# Altium schematic sheet Sheet1.SchDoc
size A4
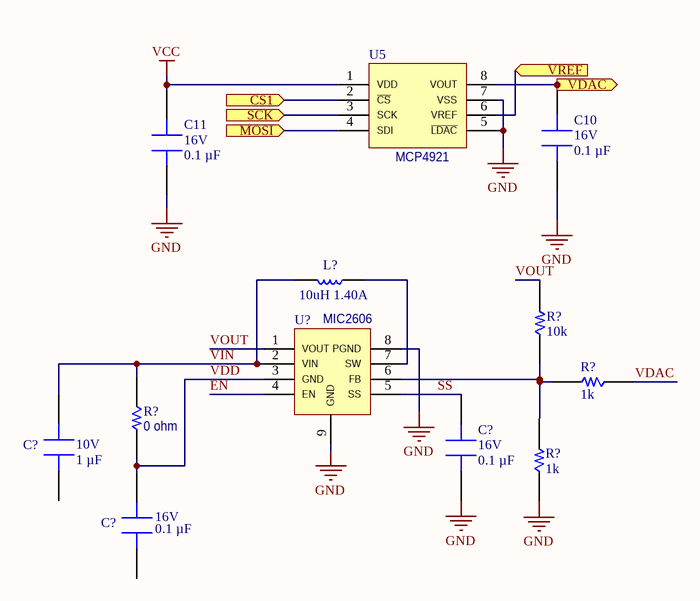
[diagram p0: Sheet1.SchDoc]

## Parts
(Parts that share a designator on the sheet are numbered #1, #2 ... from top to bottom, then left to right.)
C10  value 0.1 µF  Voltage: 16V  [C0603-N]  (hidden comment: ANCAP0UF1006030412)
C11  value 0.1 µF  Voltage: 16V  [C0603-N]  (hidden comment: ANCAP0UF1006030412)
C?#1  value 0.1 µF  Voltage - Rated: 16V  [C0603-N]  (hidden comment: ANCAP0UF1006030412)
C?#2  value 1 µF  Voltage: 10V  [C0603-N]  (hidden comment: ANCAP110040340E0000)
C?#3  value 0.1 µF  Voltage: 16V  [C0603-N]  (hidden comment: ANCAP0UF1006030412)
L?  value 10uH 1.40A  [SRU5028]  (hidden comment: ANIND10UH001A40009)
R?#1  value 10k  [0603-N]  (hidden comment: ANRES10K006031T700)
R?#2  value 1k  [0603-N]  (hidden comment: ANRES1K0006033BC00)
R?#3  value 0 ohm  [0402-N]  (hidden comment: ANRESE240000000000)
R?#4  value 1k  [0603-N]  (hidden comment: ANRES1K0006033BC00)
U5  Name: MCP4921  [MCP4921T-E/SN]  (hidden comment: ANICMCP4921EMCND00)
U?  Name: MIC2606  [MIC2606YML-TR]  (hidden comment: ANICMIC2606YMLTR00)

## Ports
CS1 (in), MOSI (in), SCK (in), VDAC (out), VREF (in)

## Nets
GND: C10.1 C11.1 C?#1.1 R?#4.1 U5.5(~{LDAC}) U5.7(VSS) U?.8(PGND) U?.9(GND)
VCC: C11.2 U5.1(VDD)
CS1: U5.2(~{CS}) ; port CS1
EN: U?.4(EN)
MOSI: U5.4(SDI) ; port MOSI
SCK: U5.3(SCK) ; port SCK
SS: C?#1.2 U?.5(SS)
VDAC: C10.2 U5.8(VOUT) ; port VDAC
VDAC: R?#2.1  [a separate net that carries the same name]
VDD: C?#3.1 R?#3.2 U?.3(GND)
VIN: C?#2.1 L?.2 R?#3.1 U?.2(VIN)
VOUT: R?#1.2 U?.1(VOUT)
VREF: U5.6(VREF) ; port VREF
NetL?_1: L?.1 U?.7(SW)
NetR?#1_1: R?#1.1 R?#2.2 R?#4.2 U?.6(FB)

Not connected (* = marked no-connect by the designer): C?#2 2; C?#3 2

## Library data of the parts
C10 C11 C?#1 C?#3 = 0603YC104JAT2A: 0.10µF ±5% 16V Ceramic Capacitor X7R 0603 (1608 Metric); Manufacturer: KYOCERA AVX; Order Number: 0603YC104JAT2A; Operating Temperature: -55°C ~ 125°C; Digi-Key Part Number: 478-3726-2-ND; Parameter 8: *; Parameter 9: *
C?#2 = CL10A105KP8NNNC: CAP CER 1UF 10V X5R 0603; Manufacturer: Samsung Electro-Mechanics; Order Number: CL10A105KP8NNNC; Operating Temperature: -55°C ~ 85°C; Digi-Key Part Number: 1276-1182-2-ND; Parameter 8: *; Parameter 9: *
L? = SRU5028-100Y: 10uH, 1.40A, -40C +125C, SRU5028-100Y; Manufacturer: Bourns Inc.; Current Rating: 1.8 A; Digi-Key Part Number: SRU5028-100YTR-ND; Operating Temperature: -40°C ~ 125°C
R?#1 = RC0603FR-0710KL: 10K 1/10W 5% 0603; Manufacturer: YAGEO; Detailed Description: 10 kOhms ±1% 0.1W, 1/10W Chip Resistor 0603 (1608 Metric) Moisture Resistant Thick Film; Digi-Key Part Number: 311-10.0KHRTR-ND; Operating Temperature: -55°C ~ 155°C
R?#2 R?#4 = CRCW06031K00FKEAHP: RES SMD 1K OHM 1% 1/3W 0603; Manufacturer: Vishay Dale; Detailed Description: 1 kOhms ±1% 0.333W, 1/3W Chip Resistor 0603 (1608 Metric) Automotive AEC-Q200, Pulse Withstanding Thick Film; Digi-Key Part Number: 541-1.00KSTR-ND; Operating Temperature: -55°C ~ 155°C
R?#3 = 6-1622826-4: 0R, 0402, Thick Film, 1/16W, %1; Manufacturer: TE Connectivity Passive Product; Manufecturer Part Number: CRG0402ZR; Detailed Description: 0 Ohms Jumper 0.063W, 1/16W Chip Resistor 0402 (1005 Metric) Thick Film; Digi-Key Part Number: A106025TR-ND; Operating Temperature: -55°C ~ 155°C
U5 = MCP4921T-E/SN: IC DAC 12BIT V-OUT 8DFN; Manufacturer: Microchip Technology; Voltage - Supply, Analog/Digital: 2.7V ~ 5.5V; Input Type: Differential; Number of Bits: 12; Operating Temperature: -40°C ~ 125°C; Digi-Key Part Number: MCP4921T-E/SNTR-ND
U? = MIC2606YML-TR: IC REG BOOST ADJ 500MA 8MLF; Manufacturer: Microchip Technology; Current - Output: 500mA (Switch); Voltage - Output (Min/Fixed): 4.5V; Operating Temperature: -40°C ~ 125°C (TJ)